# EAGLE design UniDCDC_asch (EAGLE 9.6.2)
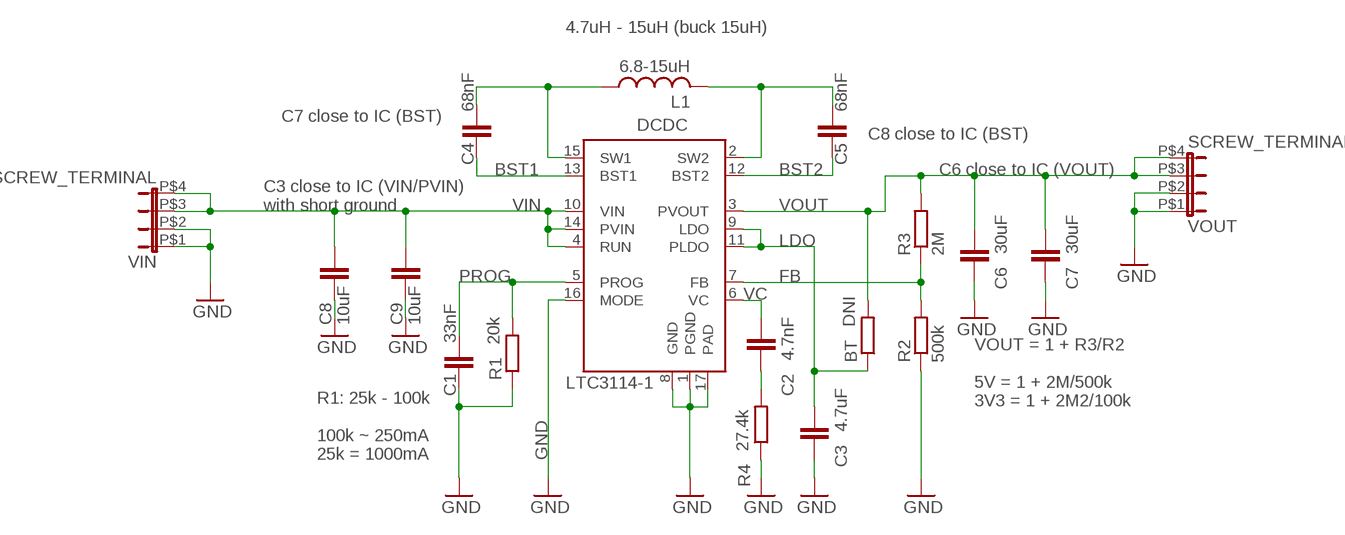
[diagram p0: schematic, sheet 1]

## Parts
BT  DNI  R-EU_R0805  [R0805]
C1  33nF  C-EUC0805K  [C0805K]
C2  4.7nF  C-EUC0805K  [C0805K]
C3  4.7uF  C-EUC0805K  [C0805K]
C4  68nF  C-EUC0805K  [C0805K]
C5  68nF  C-EUC0805K  [C0805K]
C6  30uF  C-EUC0805K  [C0805K]
C7  30uF  C-EUC0805K  [C0805K]
C8  10uF  C-EUC0805K  [C0805K]
C9  10uF  C-EUC0805K  [C0805K]
DCDC  LTC3114-1  [TSSOP16]
L1  6.8-15uH  MSS1278  [MSS1278_SMD]
R1  20k  R-EU_R0805  [R0805]
R2  500k  R-EU_R0805  [R0805]
R3  2M  R-EU_R0805  [R0805]
R4  27.4k  R-EU_R0805  [R0805]
VIN  SCREW_TERMINAL  [SCREW_TERMINAL]
VOUT  SCREW_TERMINAL  [SCREW_TERMINAL]

## Nets
BST1: C4.2 DCDC.13(BST1)
BST2: C5.2 DCDC.12(BST2)
FB: DCDC.7(FB) R2.2 R3.1
GND: C1.2 C3.2 C6.2 C7.2 C8.2 C9.2 DCDC.1(PGND) DCDC.8(GND) DCDC.16(MODE) DCDC.17(PAD) R1.1 R2.1 R4.1 VIN.P$1 VIN.P$2 VOUT.P$1 VOUT.P$2
LDO: BT.1 C3.1 DCDC.9(LDO) DCDC.11(PLDO)
N$6: C2.2 R4.2
N$11: C4.1 DCDC.15(SW1) L1.P$1
N$12: C5.1 DCDC.2(SW2) L1.P$2
PROG: C1.1 DCDC.5(PROG) R1.2
VC: C2.1 DCDC.6(VC)
VIN: C8.1 C9.1 DCDC.4(RUN) DCDC.10(VIN) DCDC.14(PVIN) VIN.P$3 VIN.P$4
VOUT: BT.2 C6.1 C7.1 DCDC.3(PVOUT) R3.2 VOUT.P$3 VOUT.P$4

## Notes on the sheet
- 4.7uH - 15uH (buck 15uH)
- C7 close to IC (BST)
- C8 close to IC (BST)
- C6 close to IC (VOUT)
- C3 close to IC (VIN/PVIN)
  with short ground
- VOUT = 1 + R3/R2
  
  5V = 1 + 2M/500k
  3V3 = 1 + 2M2/100k
- R1: 25k - 100k
  
  100k ~ 250mA
  25k = 1000mA

## Library data of the parts
BT R1-R4 = rcl:R-EU_: RESISTOR, European symbol; SPICEPREFIX: R
C1-C9 = rcl:C-EU: CAPACITOR, European symbol; SPICEPREFIX: C
DCDC = uni_dcdc:LTC3114-1
L1 = uni_dcdc:MSS1278
VIN VOUT = uni_dcdc:SCREW_TERMINAL

## Board
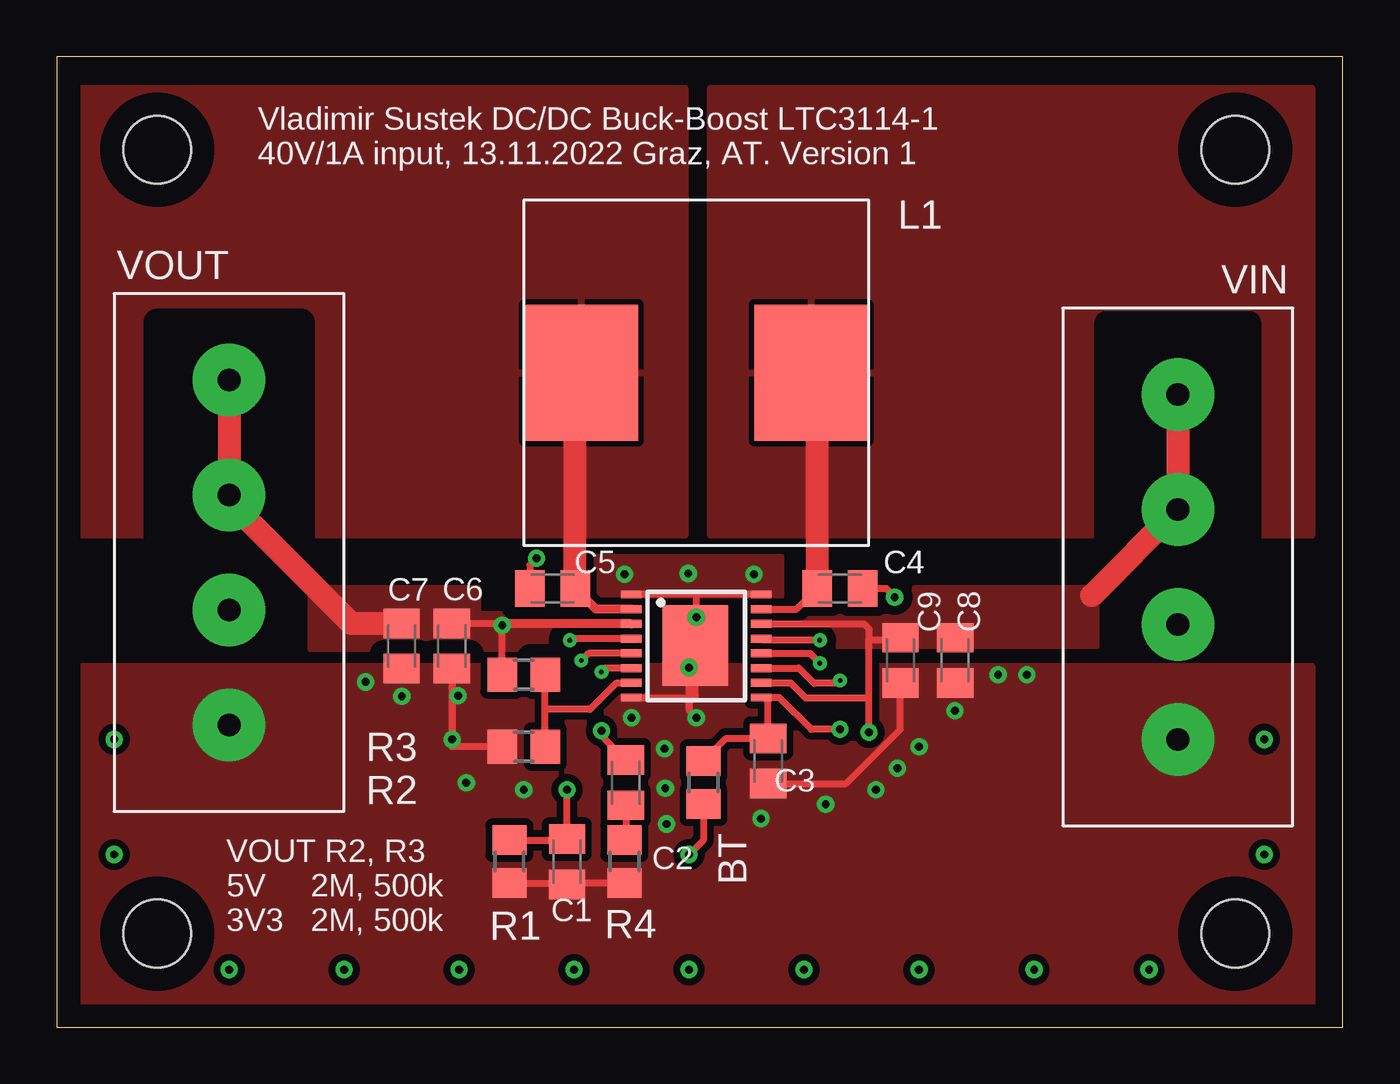
[diagram p1: board, top side]
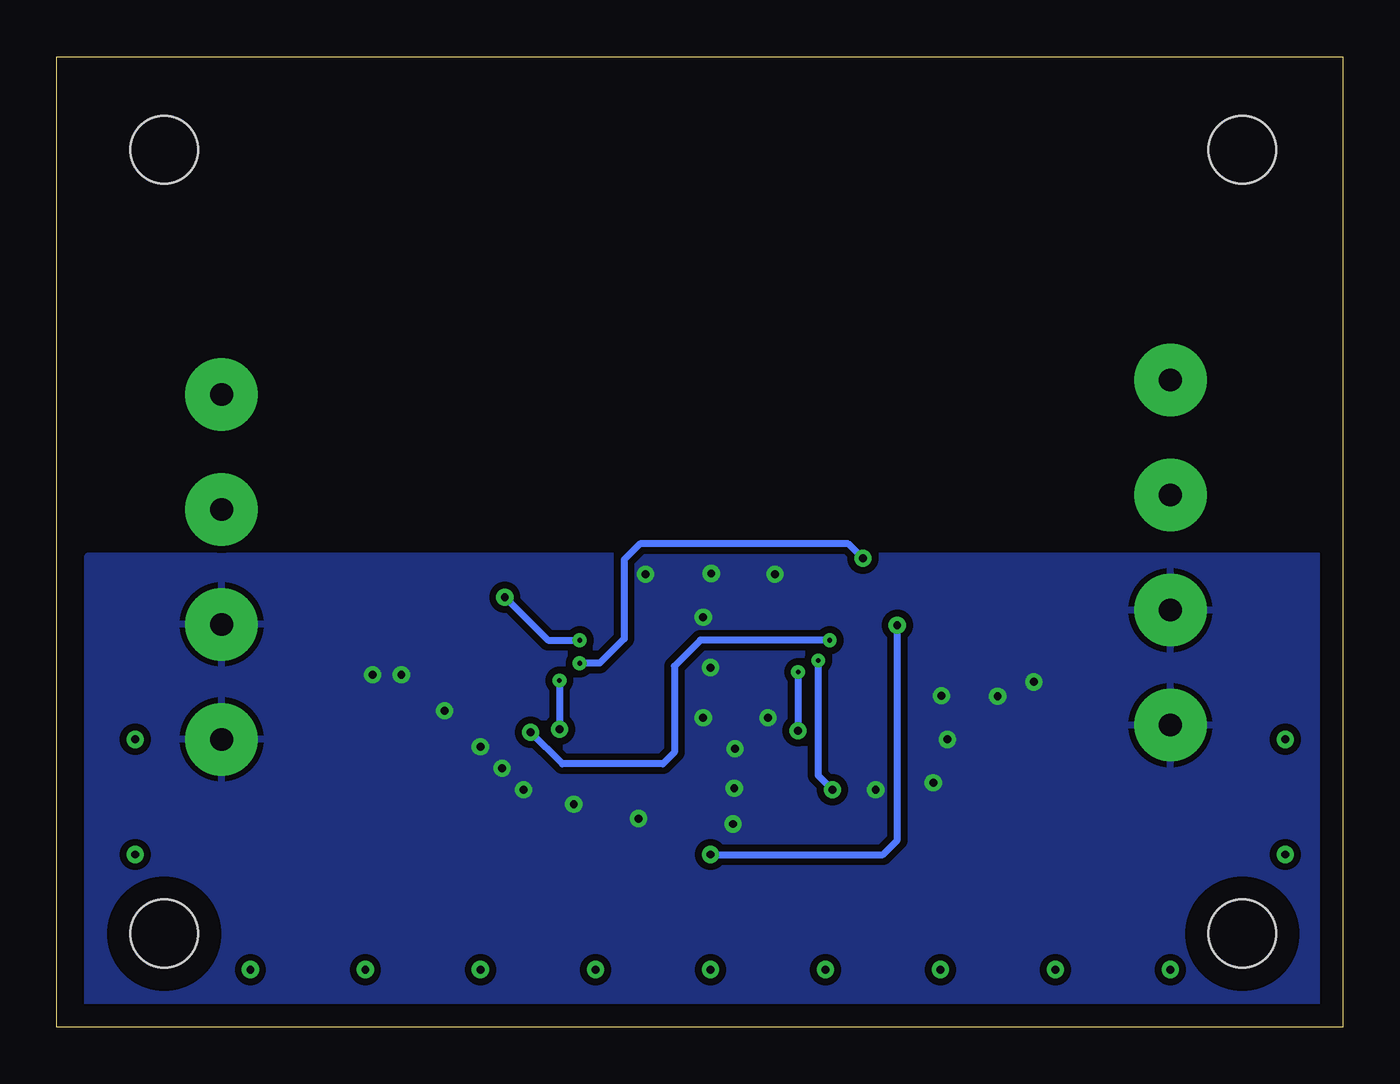
[diagram p2: board, bottom side, seen from below]

Size 56.82 x 42.85 mm. Coordinates in mm from the lower left corner, seen from the top.
Outline: 0,0 56.82,0 56.82,42.85 0,42.85 0,0
Copper layers (1*16): Top 0.035mm / dielectric 1.5mm / Bottom 0.035mm
Design rules "default *": minimum track width 6mil, minimum drill 0.2mm, track to track 6mil, track to pad 6mil, pad to pad 6mil, via to via 6mil, smd to smd 6mil, copper to edge 40mil, drill to drill 6mil, minimum pad ring 10mil, minimum via ring 8mil, stop-mask expansion 4mil, vias tented up to drill 0mil, thermal gap 10mil
Holes 3 mm at 4.45,38.73 52.07,4.13 52.07,38.73 4.45,4.13
tRestrict: area 4.4,21.6 to 10.8,31.1; area 46.4,21.6 to 52.7,31.1

### Footprints (pad centres in the part's own frame; a part is rotated, then mirrored left to right if it is on the bottom)
R0805 = smd 1.3 x 1.5: 1 -0.95,0; 2 0.95,0
C0805K = smd 1.3 x 1.6: 1 -1,0; 2 1,0
TSSOP16 = smd 0.9 x 0.35: 1 -2.875,2.275; 2 -2.875,1.625; 3 -2.875,0.975; 4 -2.875,0.325; 5 -2.875,-0.325; 6 -2.875,-0.975; 7 -2.875,-1.625; 8 -2.875,-2.275; 9 2.875,-2.275; 10 2.875,-1.625; 11 2.875,-0.975; 12 2.875,-0.325; 13 2.875,0.325; 14 2.875,0.975; 15 2.875,1.625; 16 2.875,2.275 | smd 2.9 x 3.55: 17 -0.052,0.018
MSS1278_SMD = smd 6 x 5: P$1 0,5.08; P$2 0,-5.08
SCREW_TERMINAL = drill 1 pad 3.2: P$1 -7.62,0; P$2 -2.54,0; P$3 2.54,0; P$4 7.62,0

### Placement (x,y rotation side)
BT  28.57,10.79 270 top
C1  22.54,7.3 270 top
C2  25.15,10.79 270 top
C3  31.43,11.75 270 top
C4  34.61,19.37 0 top
C5  21.91,19.37 180 top
C6  17.46,16.83 270 top
C7  15.24,16.83 270 top
C8  39.69,16.19 270 top
C9  37.27,16.19 270 top
DCDC  28.26,16.83 0 top
L1  28.26,28.89 270 top
R1  20,7.3 90 top
R2  20.64,12.38 0 top
R3  20.64,15.56 180 top
R4  25.08,7.3 90 top
VIN  49.53,20.32 90 top
VOUT  7.62,20.95 90 top

### Tracks (layer width: path | path; a pad name or v marks a point on that pad's centre or on a via)
BST1  (via drill 0.2, 0.35)
  Top 0.305: C4.2 36.64,19.37 v37.02,18.99 | v33.72,17.08 31.2,17.08 DCDC.13
  Bottom 0.305: v37.02,18.99 35.12,17.08 v33.72,17.08
BST2  (via drill 0.2, 0.35)
  Top 0.305: DCDC.12 33.28,16.5 v33.72,16.07 | v21.21,20.7 20.91,20.4 C5.2
  Bottom 0.305: v21.21,20.7 21.84,21.34 31.05,21.34 31.75,20.64 31.75,17.14 32.83,16.07 v33.72,16.07
FB
  Top 0.305: R2.2 21.59,14.03 | 21.59,14.03 R3.1 | DCDC.7 25.36,15.18 24.7,15.18 23.56,14.03 21.59,14.03
GND  (via drill 0.35)
  Top 0.305: DCDC.16 28.26,19.1 | 28.26,19.1 DCDC.1 | DCDC.8 28.14,14.55 28.2,14.62 DCDC.17 | DCDC.17 28.26,16.9 v28.26,18.1 28.26,19.1 | C6.2 17.46,12.38 R2.1 | R4.1 22.59,6.35 | 22.59,6.35 C1.2 | R1.1 22.59,6.35 | C3.2 34.88,10.75 37.27,13.14 C9.2 | DCDC.17 27.94,16.58 v27.94,15.88 27.94,13.97 v28.26,13.65
  other vias: 13.65,15.24 17.74,14.63 18.1,10.79 17.46,12.7 42.86,15.56 15.25,14.61 20.64,10.48 25.4,13.65 33.97,9.84 36.2,10.48 37.15,11.43 39.69,13.97 38.1,12.38 26.89,10.54 41.59,15.56 30.8,20 25.08,20 26.94,8.97 31.11,9.21 26.85,12.29 27.9,20.03
  pour Top (isolate 0.305, no thermals): 1.08,15.94 55.44,15.94 55.44,0.7 1.08,0.7
  pour Bottom (isolate 0.305): 1.08,20.8 1.08,0.7 55.44,0.7 55.44,20.8
  pour Top (isolate 0.305, no thermals): 23.81,20.8 23.81,19 32.07,19 32.07,20.8
LDO  (via drill 0.2, 0.35)
  Top 0.305: DCDC.11 32.79,15.85 33.47,15.18 34.61,15.18 v34.61,15.3 | v34.61,13.14 33.34,13.14 31.93,14.55 DCDC.9 31.14,14.54 31.43,14.54 C3.1 29.58,12.75 BT.1
  Bottom 0.305: v34.61,15.3 v34.61,13.14
N$1  (via drill 0.35)
  other vias: 2.54,7.62
N$2  (via drill 0.35)
  other vias: 2.54,12.7
N$4  (via drill 0.35)
  other vias: 7.62,2.54
N$5  (via drill 0.35)
  other vias: 12.7,2.54
N$6
  Top 0.305: C2.2 25.15,8.32 R4.2
N$7  (via drill 0.35)
  other vias: 17.78,2.54
N$8  (via drill 0.35)
  other vias: 22.86,2.54
N$9  (via drill 0.35)
  other vias: 27.94,2.54
N$10  (via drill 0.35)
  other vias: 33.02,2.54
N$11
  Top 0.305: DCDC.15 32.69,18.45 C4.1 | 33.61,28.62 L1.P$1
  Top 1.016: C4.1 33.61,28.62
  pour Top (isolate 0.305): 55.44,21.72 28.89,21.72 28.89,41.47 55.44,41.47
N$12
  Top 0.305: 22.91,28.62 L1.P$2
  Top 0.406: DCDC.2 23.82,18.45 C5.1
  Top 1.016: C5.1 22.91,28.62
  pour Top (isolate 0.406): 27.75,21.72 1.08,21.72 1.08,41.47 27.75,41.47
N$13  (via drill 0.35)
  other vias: 38.1,2.54
N$14  (via drill 0.35)
  other vias: 43.18,2.54
N$15  (via drill 0.35)
  other vias: 48.26,2.54
N$16  (via drill 0.35)
  other vias: 53.34,7.62
N$17  (via drill 0.35)
  other vias: 53.34,12.7
PROG  (via drill 0.2, 0.35)
  Top 0.305: R1.2 22.49,8.25 C1.1 v22.54,10.48 | DCDC.5 23.49,16.5 v23.18,16.19
  Bottom 0.305: v23.18,16.19 23.18,11.11 v22.54,10.48
VC  (via drill 0.2, 0.35)
  Top 0.305: DCDC.6 24.23,15.85 v24.07,15.68 | v24.07,13.08 24.07,12.87 C2.1
  Bottom 0.305: v24.07,15.68 v24.07,13.08
VIN  (via drill 0.2, 0.35)
  Top 0.305: DCDC.10 32.42,15.2 33.08,14.54 35.88,14.54 | 35.88,14.54 35.88,17.08 | DCDC.14 35.66,17.8 35.88,17.59 35.88,17.08 | DCDC.4 22.74,17.15 v22.67,17.08 | v35.88,13.02 35.88,14.54 | C9.1 37.16,17.08 35.88,17.08
  Top 1.016: VIN.P$4 VIN.P$3 45.72,19.05
  Bottom 0.305: v22.67,17.08 28.38,17.08 29.53,15.94 29.53,12.13 30.04,11.62 34.48,11.62 v35.88,13.02
  pour Top (isolate 0.406, no thermals): 31.81,18.48 37.91,18.48 37.91,19.37 45.91,19.37 45.91,16.83 31.81,16.83
VOUT  (via drill 0.35)
  Top 0.305: C6.1 17.49,17.8 19.62,17.8 v19.69,17.74 R3.2 | BT.2 28.57,8.26 v27.94,7.62
  Top 0.406: DCDC.3 19.62,17.8
  Top 1.016: C7.1 13.02,17.83 7.62,23.23 VOUT.P$3 VOUT.P$4
  Bottom 0.305: v27.94,7.62 20.32,7.62 19.68,8.26 v19.68,17.73 v19.69,17.74
  pour Top (isolate 0.61, no thermals): 11.24,19.37 18.61,19.37 18.61,18.22 22.8,18.22 22.8,16.7 11.24,16.7

### Text on the board
tPlace: Vladimir Sustek DC/DC Buck-Boost LTC3114-1 / 40V/1A input, 13.11.2022 Graz, AT. Version 1 | VOUT R2, R3 / 5V 2M, 500k / 3V3 2M, 500k